# EAGLE design analog-daughter-as-built (EAGLE 6.6.0)
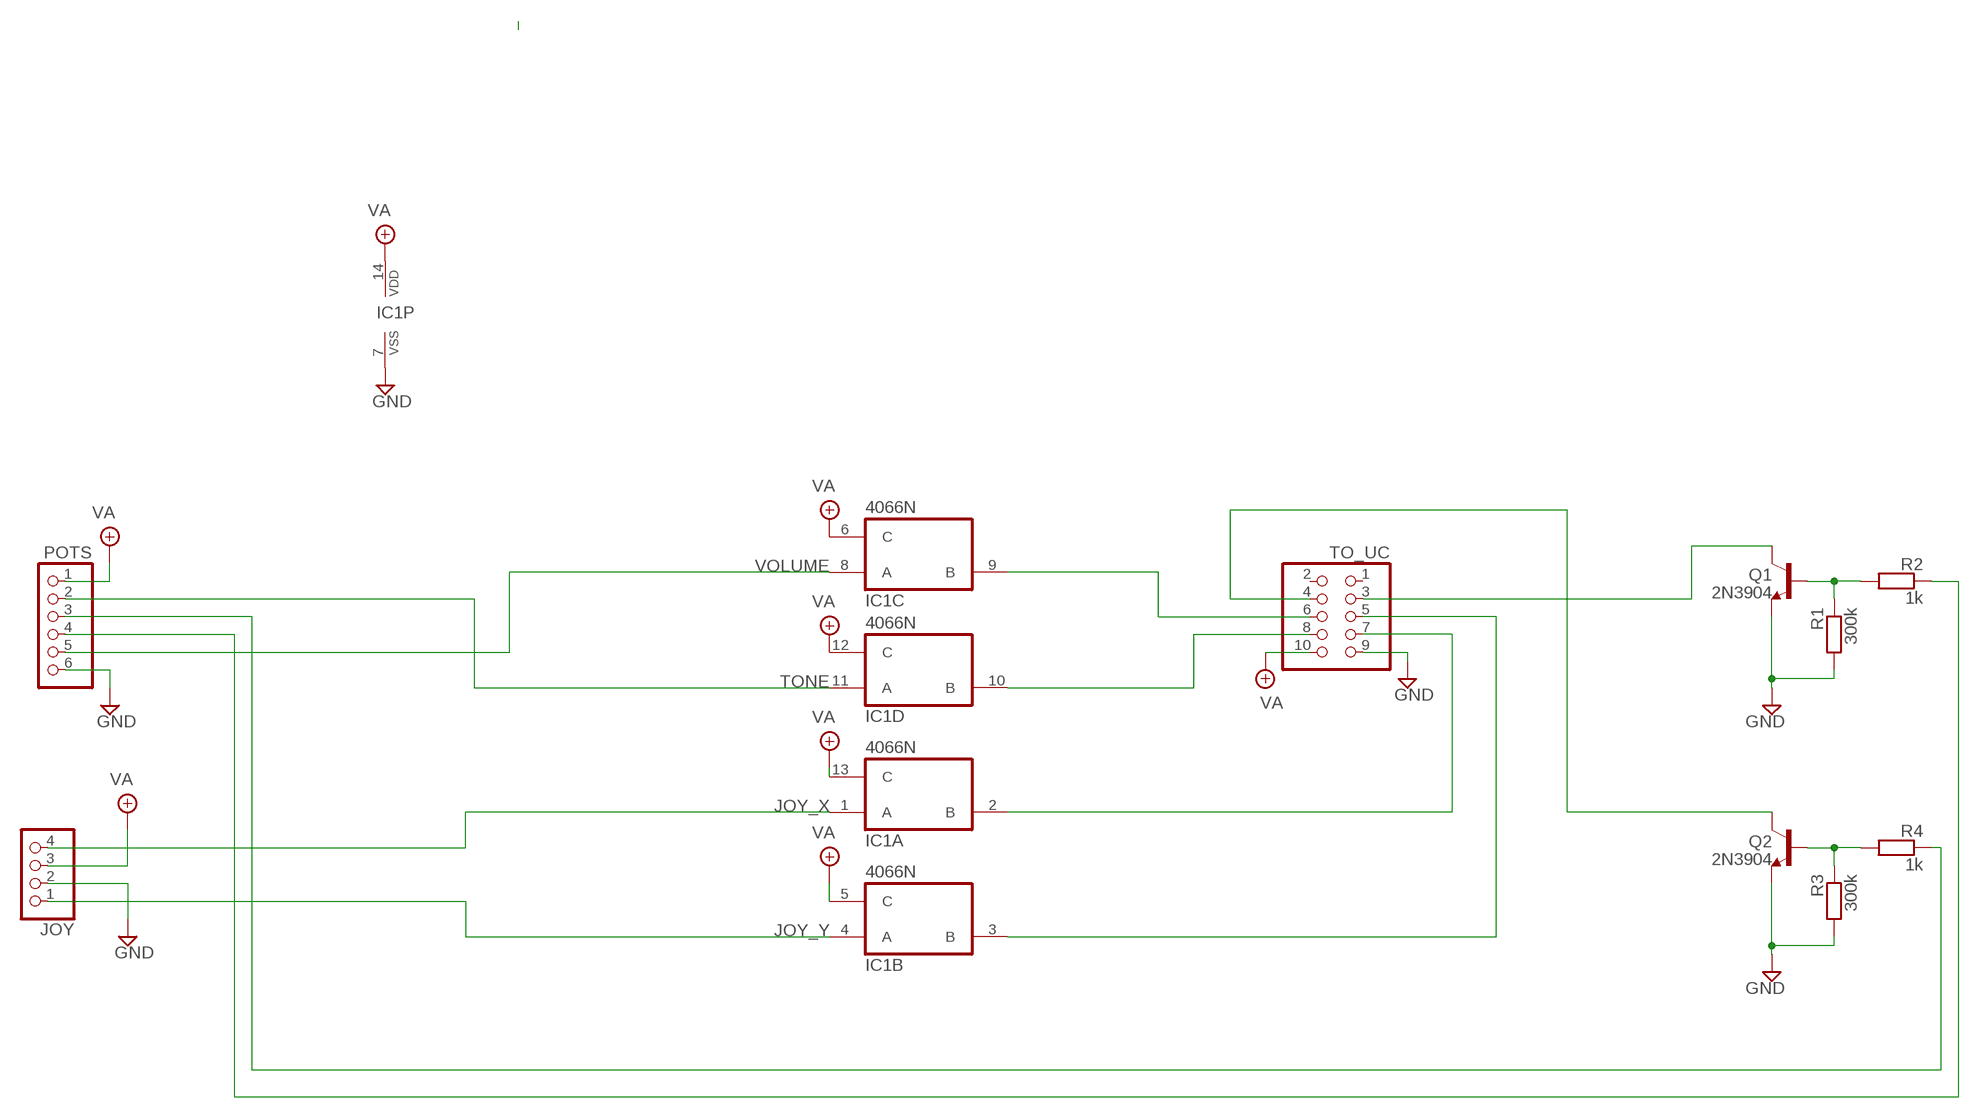
[diagram p0: schematic, sheet 1]

## Parts
IC1  4066N  [DIL14]
JOY  PINHD-1X4  [1X04]
POTS  PINHD-1X6  [1X06]
Q1  2N3904  [TO92-]
Q2  2N3904  [TO92-]
R1  300k  6MM-EU1  [R0207/1V]
R2  1k  6MM-EU1  [R0207/1V]
R3  300k  6MM-EU1  [R0207/1V]
R4  1k  6MM-EU1  [R0207/1V]
TO_UC  PINHD-2X5  [2X05]

## Nets
GND: IC1.7(P:VSS) JOY.2 POTS.6 Q1.3(E) Q2.3(E) R1.2 R3.2 TO_UC.9
JOY_X: IC1.1(A:A) JOY.4
JOY_Y: IC1.4(B:A) JOY.1
N$2: Q1.1(C) TO_UC.3
N$3: IC1.9(C:B) TO_UC.6
N$4: IC1.10(D:B) TO_UC.8
N$5: IC1.2(A:B) TO_UC.7
N$6: IC1.3(B:B) TO_UC.5
N$9: Q2.1(C) TO_UC.4
N$11: Q1.2(B) R1.1 R2.2
N$12: Q2.2(B) R3.1 R4.2
TONE: IC1.11(D:A) POTS.2
TONE_BUTTON: POTS.3 R4.1
VA: IC1.5(B:C) IC1.6(C:C) IC1.12(D:C) IC1.13(A:C) IC1.14(P:VDD) JOY.3 POTS.1 TO_UC.10
VOL_BUTTON: POTS.4 R2.1
VOLUME: IC1.8(C:A) POTS.5
Unconnected: TO_UC.1 TO_UC.2

## Library data of the parts
IC1 = 40xx:4066: Quad bilateral ANALOG SWITCH
JOY = pinhead:PINHD-1X4: PIN HEADER
POTS = pinhead:PINHD-1X6: PIN HEADER
Q1 Q2 = gm-trans:2N3904: NPN Transistor
R1-R4 = gm-resistors:6MM-EU: 6mm Resistors (European schematic symbol) Leads spaced 1-6 holes apart for 0.1" perfboard. Suitable for 1/4 watt resistors.
TO_UC = pinhead:PINHD-2X5: PIN HEADER

## Board
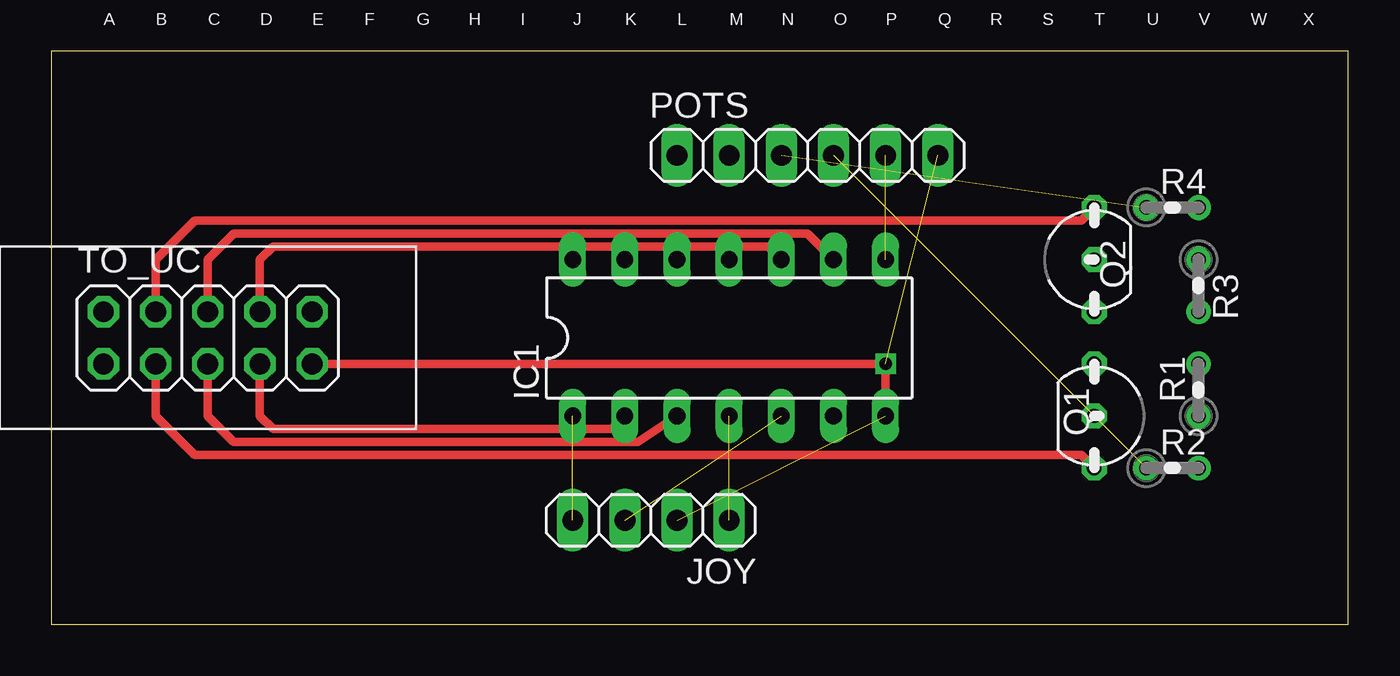
[diagram p1: board, top side]
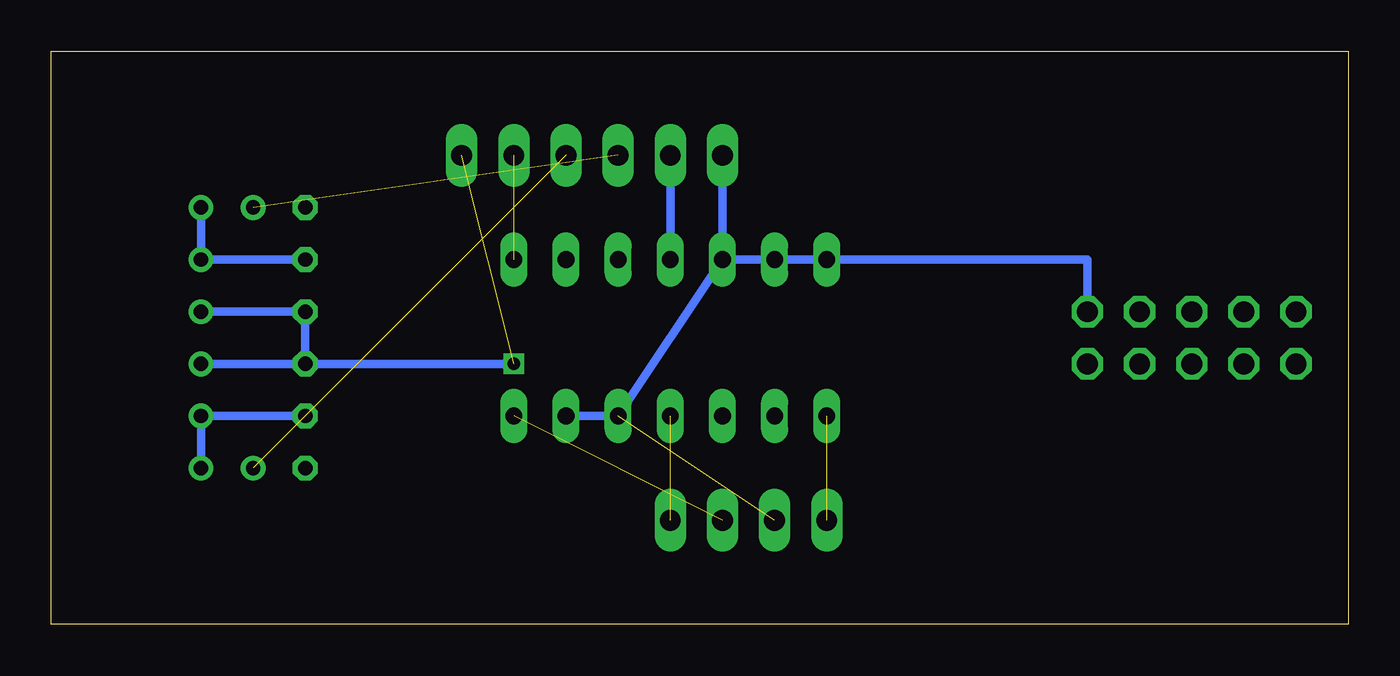
[diagram p2: board, bottom side, seen from below]

Size 63.17 x 27.93 mm. Coordinates in mm from the lower left corner, seen from the top.
Outline: 0,0 63.17,0 63.17,27.93 0,27.93 0,0
Copper layers (1*16): Top 0.035mm / dielectric 1.5mm / Bottom 0.035mm
Design rules "default": minimum track width 10mil, minimum drill 24mil, track to track 8mil, track to pad 8mil, pad to pad 8mil, via to via 8mil, smd to smd 8mil, copper to edge 40mil, drill to drill 8mil, minimum pad ring 10mil, minimum via ring 8mil, stop-mask expansion 4mil, vias tented up to drill 0mil, thermal gap 10mil

### Footprints (pad centres in the part's own frame; a part is rotated, then mirrored left to right if it is on the bottom)
DIL14 = drill 0.813 long: 1 -7.62,-3.81; 2 -5.08,-3.81; 3 -2.54,-3.81; 4 0,-3.81; 5 2.54,-3.81; 6 5.08,-3.81; 7 7.62,-3.81; 8 7.62,3.81; 9 5.08,3.81; 10 2.54,3.81; 11 0,3.81; 12 -2.54,3.81; 13 -5.08,3.81; 14 -7.62,3.81
1X04 = drill 1.016 long: 1 -3.81,0; 2 -1.27,0; 3 1.27,0; 4 3.81,0
1X06 = drill 1.016 long: 1 -6.35,0; 2 -3.81,0; 3 -1.27,0; 4 1.27,0; 5 3.81,0; 6 6.35,0
TO92- = drill 0.7 octagon: 1 2.54,0; 2 0,0; 3 -2.54,0
R0207/1V = drill 0.7: 1 -1.27,0; 2 1.27,0
2X05 = drill 1.016 octagon: 1 -5.08,-1.27; 2 -5.08,1.27; 3 -2.54,-1.27; 4 -2.54,1.27; 5 0,-1.27; 6 0,1.27; 7 2.54,-1.27; 8 2.54,1.27; 9 5.08,-1.27; 10 5.08,1.27

### Placement (x,y rotation side)
IC1  33.02,13.97 0 top
JOY  29.21,5.08 180 top
POTS  36.83,22.86 0 top
Q1  50.8,10.16 270 top
Q2  50.8,17.78 90 top
R1  55.88,11.43 90 top
R2  54.61,7.62 0 top
R3  55.88,16.51 270 top
R4  54.61,20.32 0 top
TO_UC  7.62,13.97 0 top

### Tracks (layer width: path | path; a pad name or v marks a point on that pad's centre or on a via)
GND  (via drill 0.6)  (2 unrouted)
  Top 0.406: TO_UC.9 v40.64,12.7 IC1.7
  Bottom 0.406: R3.2 Q2.3 Q1.3 | R1.2 Q1.3 | v40.64,12.7 Q1.3
JOY_X  (1 unrouted)
JOY_Y  (1 unrouted)
N$2
  Top 0.406: TO_UC.3 5.08,10.16 6.99,8.26 50.16,8.26 Q1.1
N$3
  Top 0.406: TO_UC.6 7.62,17.78 8.89,19.05 36.83,19.05 IC1.9
N$4
  Top 0.406: TO_UC.8 10.16,17.78 10.79,18.41 34.92,18.41 IC1.10
N$5
  Top 0.406: IC1.2 27.3,9.53 10.79,9.53 10.16,10.16 TO_UC.7
N$6
  Top 0.406: TO_UC.5 7.62,10.16 8.89,8.89 28.57,8.89 IC1.3
N$9
  Top 0.406: TO_UC.4 5.08,17.78 6.99,19.68 50.16,19.68 Q2.1
N$11
  Bottom 0.406: Q1.2 R1.1 R2.2
N$12
  Bottom 0.406: Q2.2 R3.1 R4.2
TONE
  Bottom 0.406: POTS.2 IC1.11
TONE_BUTTON  (1 unrouted)
VA  (1 unrouted)
  Bottom 0.406: IC1.12 IC1.13 IC1.14 12.7,17.78 TO_UC.10 | IC1.6 IC1.5 IC1.12 | POTS.1 IC1.12
VOL_BUTTON  (1 unrouted)
VOLUME  (1 unrouted)

### Text on the board
tNames: A | B | C | D | E | F | G | H | I | J | K | L | M | N | O | P | Q | R | S | T | U | V | W | X